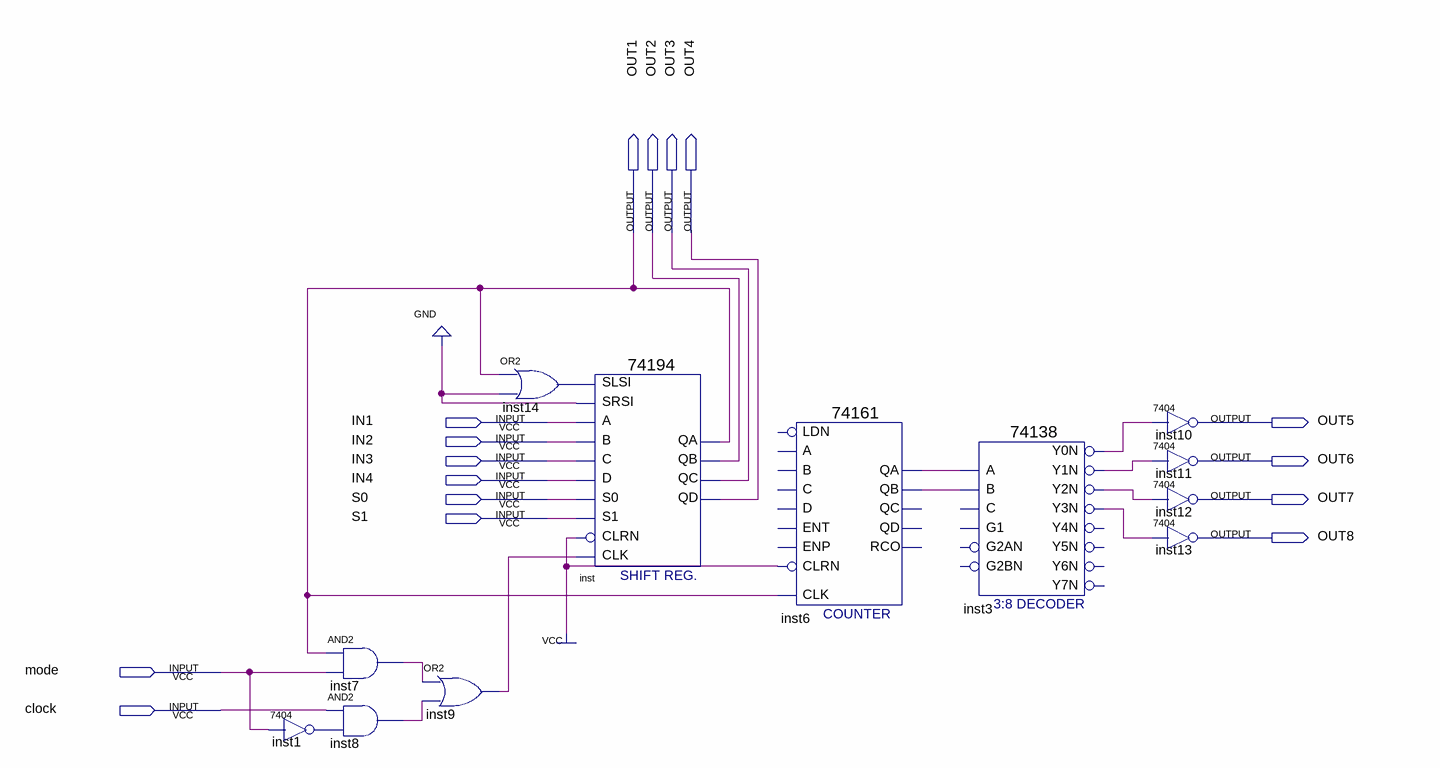
[diagram p0: schematic sheet]
// Quartus schematic experiment12.bdf as structural Verilog: 12 symbols, 16 pins
module experiment12 (
  input  IN1,
  input  IN2,
  input  IN3,
  input  IN4,
  input  S0,
  input  S1,
  input  mode,
  input  clock,
  output OUT1,
  output OUT2,
  output OUT3,
  output OUT4,
  output OUT5,
  output OUT6,
  output OUT7,
  output OUT8
);

  wire inst1_1, inst3_y0n, inst3_y1n, inst3_y2n, inst3_y3n, inst6_qa, inst6_qb, inst7_out, inst8_out,
       inst9_out, inst14_out;

  and inst7 (inst7_out, OUT1, mode);
  and inst8 (inst8_out, clock, inst1_1);
  \7404  inst1 (.\2 (mode), .\1 (inst1_1));
  or inst9 (inst9_out, inst7_out, inst8_out);
  or inst14 (inst14_out, OUT1, 1'b0);
  \74194  inst (
    .SLSI(inst14_out), .SRSI(1'b0), .B(IN2), .C(IN3), .CLK(inst9_out), .CLRN(1'b1), .D(IN4), .S1(S1),
    .S0(S0), .A(IN1), .QA(OUT1), .QB(OUT2), .QC(OUT3), .QD(OUT4));
  \74161  inst6 (
    .CLRN(1'b1), .CLK(OUT1), .QB(inst6_qb), .QA(inst6_qa));  // open: ENP, LDN, A, D, ENT, B, C, QD, QC, RCO
  \74138  inst3 (
    .A(inst6_qa), .B(inst6_qb), .Y0N(inst3_y0n), .Y1N(inst3_y1n), .Y2N(inst3_y2n), .Y3N(inst3_y3n));  // open: G1, C, G2AN, G2BN, Y4N, Y5N, Y6N, Y7N
  \7404  inst10 (.\2 (inst3_y0n), .\1 (OUT5));
  \7404  inst11 (.\2 (inst3_y1n), .\1 (OUT6));
  \7404  inst12 (.\2 (inst3_y2n), .\1 (OUT7));
  \7404  inst13 (.\2 (inst3_y3n), .\1 (OUT8));
endmodule
